# Altium project Fuel_Gauge_Module.PrjPcb
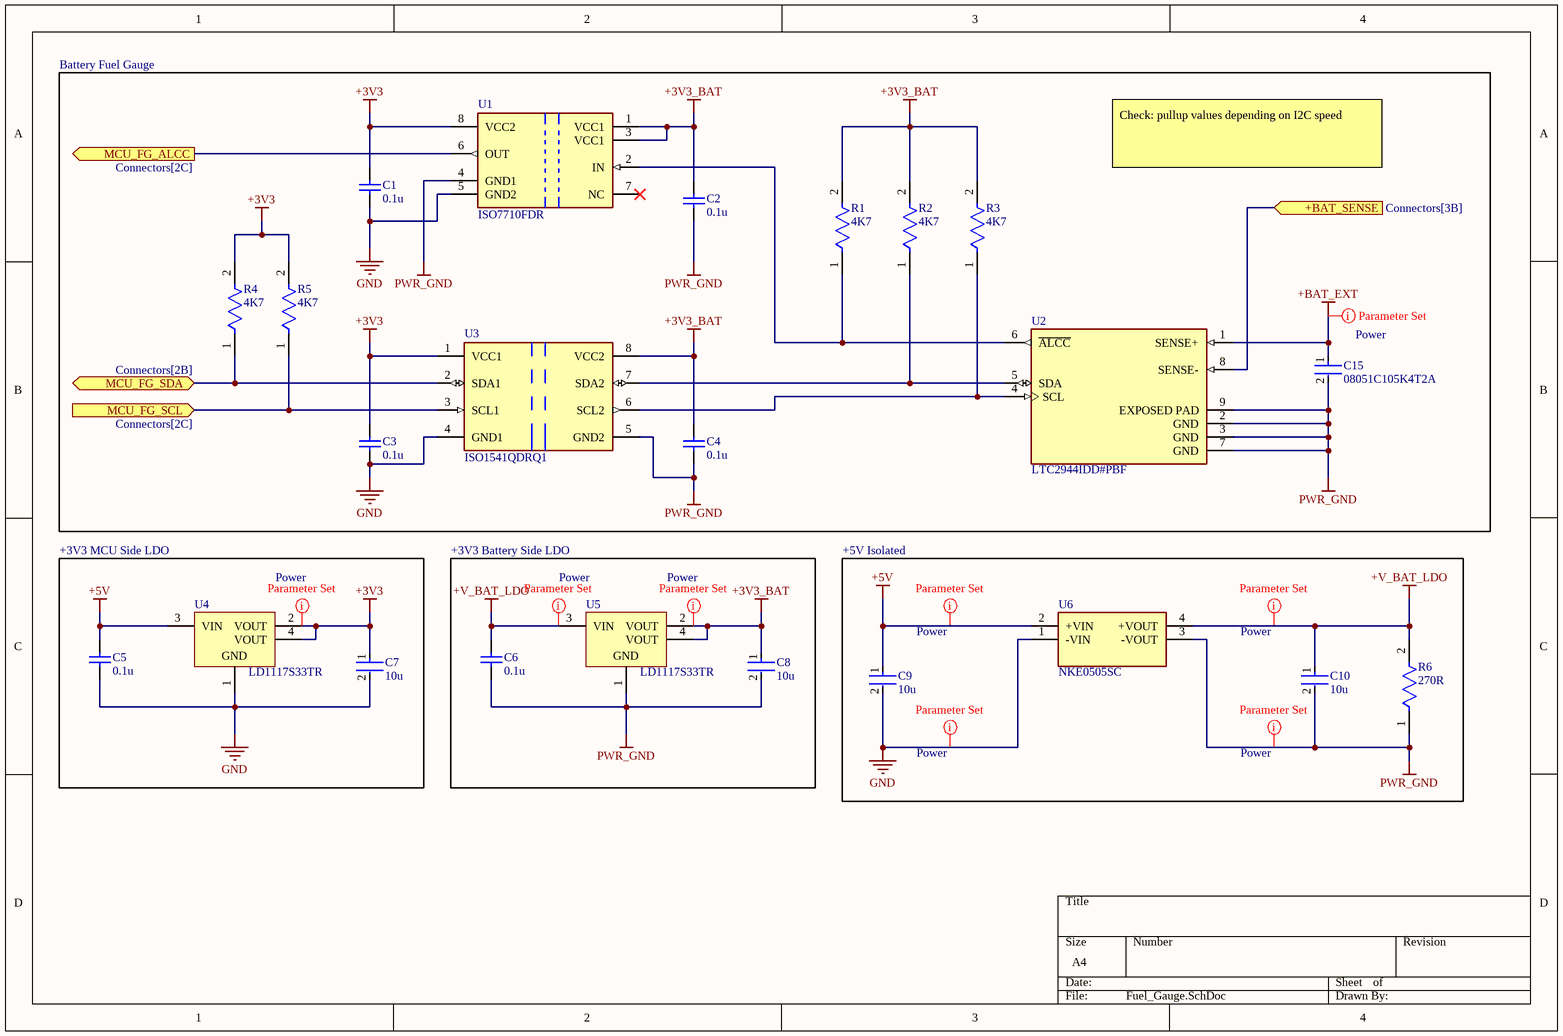
[diagram p0: Fuel_Gauge.SchDoc]
2 sheets, 31 parts. Net scope: flat (ports and power ports of the same name join across sheets).
Board file: Fuel_Gauge.PcbDoc
Sheets:
  Fuel_Gauge.SchDoc
  Connectors.SchDoc

## Sheet Fuel_Gauge.SchDoc
size A4; SheetNumber: 1; SheetTotal: 2

### Parts
C1  0.1u  [CAPC2013X145X48NL20T23]
C2  0.1u  [CAPC2013X145X48NL20T23]
C3  0.1u  [CAPC2013X145X48NL20T23]
C4  0.1u  [CAPC2013X145X48NL20T23]
C5  0.1u  [CAPC2013X145X48NL20T23]
C6  0.1u  [CAPC2013X145X48NL20T23]
C7  10u  [FP-CC1206-FD-MFG]
C8  10u  [FP-CC1206-FD-MFG]
C9  10u  [FP-CC1206-FD-MFG]
C10  10u  [FP-CC1206-FD-MFG]
C15  08051C105K4T2A  [FP-0805-L_2_01_0_2-W_1_25-MFG]
R1  4K7  [FP-RT0805-MFG]
R2  4K7  [FP-RT0805-MFG]
R3  4K7  [FP-RT0805-MFG]
R4  4K7  [FP-RT0805-MFG]
R5  4K7  [FP-RT0805-MFG]
R6  270R  [FP-AF1206-IPC_A]
U1  ISO7710FDR  [FP-D0008B-MFG]
U2  LTC2944IDD#PBF  [FP-DD-8-05-08-1698-MFG]
U3  ISO1541QDRQ1  [FP-D0008A-IPC_B]
U4  LD1117S33TR  [SOT-223_L]
U5  LD1117S33TR  [SOT-223_L]
U6  NKE0505SC  [FP-NKE-SIP-MFG]

### Blocks framed on the sheet
Battery Fuel Gauge: C1-C4 C15 R1-R5 U1-U3
+3V3 MCU Side LDO: C5 C7 U4
+3V3 Battery Side LDO: C6 C8 U5
+5V Isolated: C9 C10 R6 U6

### Ports
+BAT_SENSE (in, see Connectors[3B]), MCU_FG_ALCC (out, see Connectors[2C]), MCU_FG_SCL (in, see Connectors[2C]), MCU_FG_SDA (bidir, see Connectors[2B])

### Nets
+3V3: C1.2 C3.2 C7.1 R4.2 R5.2 U1.8(VCC2) U3.1(VCC1) U4.2(VOUT) U4.4(VOUT)
+3V3_BAT: C2.2 C4.2 C8.1 R1.2 R2.2 R3.2 U1.1(VCC1) U1.3(VCC1) U3.8(VCC2) U5.2(VOUT) U5.4(VOUT)
+5V: C5.2 C9.1 U4.3(VIN) U6.2(+VIN)
+BAT_EXT: C15.1 U2.1(SENSE+)
+V_BAT_LDO: C6.2 C10.1 R6.2 U5.3(VIN) U6.4(+VOUT)
GND: C1.1 C3.1 C5.1 C7.2 C9.2 U1.5(GND2) U3.4(GND1) U4.1(GND) U6.1(-VIN)
PWR_GND: C2.1 C4.1 C6.1 C8.2 C10.2 C15.2 R6.1 U1.4(GND1) U2.2(GND) U2.3(GND) U2.7(GND) U2.9(EXPOSED_PAD) U3.5(GND2) U5.1(GND) U6.3(-VOUT)
NetJ1_9: U1.6(OUT) ; port MCU_FG_ALCC
NetJ1_13: R5.1 U3.3(SCL1) ; port MCU_FG_SCL
NetJ1_17: R4.1 U3.2(SDA1) ; port MCU_FG_SDA
NetP1_1: U2.8(SENSE-) ; port +BAT_SENSE
NetR1_1: R1.1 U1.2(IN) U2.6(~{ALCC})
NetR2_1: R2.1 U2.5(SDA) U3.7(SDA2)
NetR3_1: R3.1 U2.4(SCL) U3.6(SCL2)

Not connected (* = marked no-connect by the designer): U1 7(NC)*

### Layout directives
net class Power: +3V3, +3V3_BAT, +5V, +BAT_EXT, +V_BAT_LDO, GND, PWR_GND

### Notes on the sheet
- Check: pullup values depending on I2C speed

### Library data of the parts
C1-C6 = CMP-2007-01705-1: Part Number: VJ0805Y104KXAMR; Manufacturer: Vitramon
C7-C10 = CMP-03422-001420-1: CAP CER 10UF 50V X5R 1206; Tolerance: 10%; Voltage Rating (DC): 50V; Width: 0.063inch; Halogen Free: Halogen Free; Mount: Surface Mount; Dielectric: X5R; Max Operating Temperature: 85°C; Capacitance: 10uF; Case/Package: 1206; Voltage Rating: 50V; Lead Free: Lead Free; Thickness: 0.075inch; Min Operating Temperature: -55°C; Length: 0.126inch; Packaging: Tape and Reel; RoHS Compliant: Yes
C15 = CMP-07738-122049624-1: 08051C105K4T2A Cap Ceramic 1uF 100V X7R 10% Pad SMD 0805 125C Automotive T/R; Capacitance: 1µF; Tolerance: 10%; Dielectric: X7R; Case/Package: 0805; Material: Ceramic; Height: 1.4mm; Voltage Rating (DC): 100V; Voltage Rating: 100V; Schedule B: 8532240020; NexarPartId: 122049624; RoHS: Compliant; Lifecycle Status: Production; Min Operating Temperature: -55°C; Max Operating Temperature: 125°C
R1-R5 = CMP-03412-025396-1: RT0805 4.7KΩ 0.125W 50 ppm/°C 0.01%; Manufacturer: Yageo; Manufacturer Part Number: RT0805FRE134K7L; Tolerance: 0.0001; Voltage Rating: 150V; Category: Res; Footprint Url: http://www.yageo.com/exep/pages/download/literatures/PYu-R_Mount_10.pdf; Resistance: 4.7KΩ; Package: RT0805; Composition: Thin Film; Device Class L3: Chip SMD Resistors; Ipc Land Pattern Name: RESC200125X50; Temperature Range Low: -55°C; Lead Free: Yes; Temperature Range High: +155°C; Temperature Coefficient: 50 ppm/°C; Octopart: https://octopart.com/rt0805fre134k7l-yageo-16262042; ComponentLink2URL: http://www.yageo.com/documents/recent/PYu-RT_1-to-0.01_RoHS_L_9.pdf; Device Class L1: Passive Components; Value: 4.7KΩ; Automotive: No; Height: 0.6mm; Device Class L2: Resistors; RoHS: TRUE; Power Rating: 0.125W; Temperature: -55°C to +155°C; Series: RT; ComponentLink2Description: Datasheet
R6 = CMP-03412-047403-1: Anti-Sulfurated Chip Resistor Automotive Grade 270Ω 5% 0.25W ±100ppm/°C 1206
U1 = CMP-04872-000020-1: DGTL ISO 3000VRMS 1CH GP 8SOIC; Number of Channels: 1; Min Operating Temperature: -55°C; Max Operating Temperature: 125°C
U2 = CMP-09132-000003-1: IC BATTERY GAS GAUGE I2C 8DFN; Manufacturer: Analog Devices; Nominal Supply Current: 15-850uA; Max Supply Voltage: 60V; Number Of Cells: 1; Standoff Height: 0mm; Min Supply Voltage: 3.6V; Package: DD-8-05-08-1698; Mouser Description: LTC2944 - 60V Battery Gas Gauge with Temperature, Voltage and Current Measurement; Digikey Description: IC BATTERY GAS GAUGE I2C 8DFN; Device Class L1: Integrated Circuits (ICs); Automotive: No; Height: 0.8mm; Temperature: -40°C to +85°C; ComponentLink2Description: Datasheet; Number Of Outputs: 1; Octopart: https://octopart.com/ltc2944idd%23pbf-analog+devices-88318751; Ipc Land Pattern Name: DFN300X300X75-8; Temperature Range Low: -40°C; Lead Free: Yes; ComponentLink2URL: https://www.analog.com/media/en/technical-documentation/data-sheets/2944fa.pdf; Ambient Temperature Range Low: -40°C; Device Class L3: Battery Management; Category: IC; RoHS: TRUE; Manufacturer Part Number: LTC2944IDD#PBF; Ambient Temperature Range High: +85°C; Temperature Range High: +85°C; Device Class L2: Power Management ICs
U3 = CMP-04872-000096-1: AUTO ISO I2C 2500VRMS 2CH 8SOIC; Data Rate: 1Mbps; Number of Channels: 2; Working Voltage: 560V; Channel Type: Bidirectional; Pulse Width Distortion (PWD): 21ns; Isolated Power: No; Mount: Surface Mount; Max Operating Temperature: 125°C; Min Operating Temperature: -40°C; Packaging: Cut Tape; RoHS Compliant: Yes; Case/Package: SOIC; Number of Pins: 8
U4 U5 = CMP-0244-00310-1: Fixed Low Drop Positive Voltage Regulator, 3.3V, 4-Pin SOT-223, Tape and Reel; ComponentLink2Description: Datasheet; PackageDescription: 4-Pin SOT-223 Package, 6.5 x 3.5 mm Body, 2.3 mm Pitch, 7 mm Lead Span; PackageVersion: 2010; ComponentLink2URL: http://www.st.com/internet/com/TECHNICAL_RESOURCES/TECHNICAL_LITERATURE/DATASHEET/CD00000544.pdf; PackageReference: SOT-223; DatasheetVersion: 1/11/2011; ComponentLink1Description: Manufacturer URL; ComponentLink1URL: http://www.st.com
U6 = CMP-20596-000001-1: DC DC CONVERTER 12V 1W; Manufacturer: Murata Power Solutions Inc; Manufacturer Part Number: NKE1212SC; Switching Frequency: 115kHz; Output Type: Fixed; Min Supply Voltage: 10.8V; Switching Topology: Boost; Standoff Height: 0.4mm; Nominal Supply Current: 105mA; Output Current: 83mA; Max Supply Voltage: 13.2V; Number Of Outputs: 1; Device Class L3: Voltage Regulators - Switching; Max Power Dissipation: 1W; ComponentLink2Description: Datasheet; RoHS: TRUE; Category: IC; Digikey Description: DC DC CONVERTER 12V 1W; Lead Free: Yes; Octopart: https://octopart.com/nke1212sc-murata+power+solutions-49448374; Device Class L2: Power Management ICs; Temperature Range Low: -40°C; Height: 7.71mm; ComponentLink2URL: https://power.murata.com/pub/data/power/ncl/kdc_nke.pdf; Package: NKE-SIP; Device Class L1: Integrated Circuits (ICs); Mouser Description: Isolated DC/DC Converters 1W SNGL OUT 12-12V Single Output; Output Voltage: 12V; Automotive: No; Temperature: -40°C to +85°C; Temperature Range High: +85°C

## Sheet Connectors.SchDoc
size A4; SheetNumber: 2; SheetTotal: 2
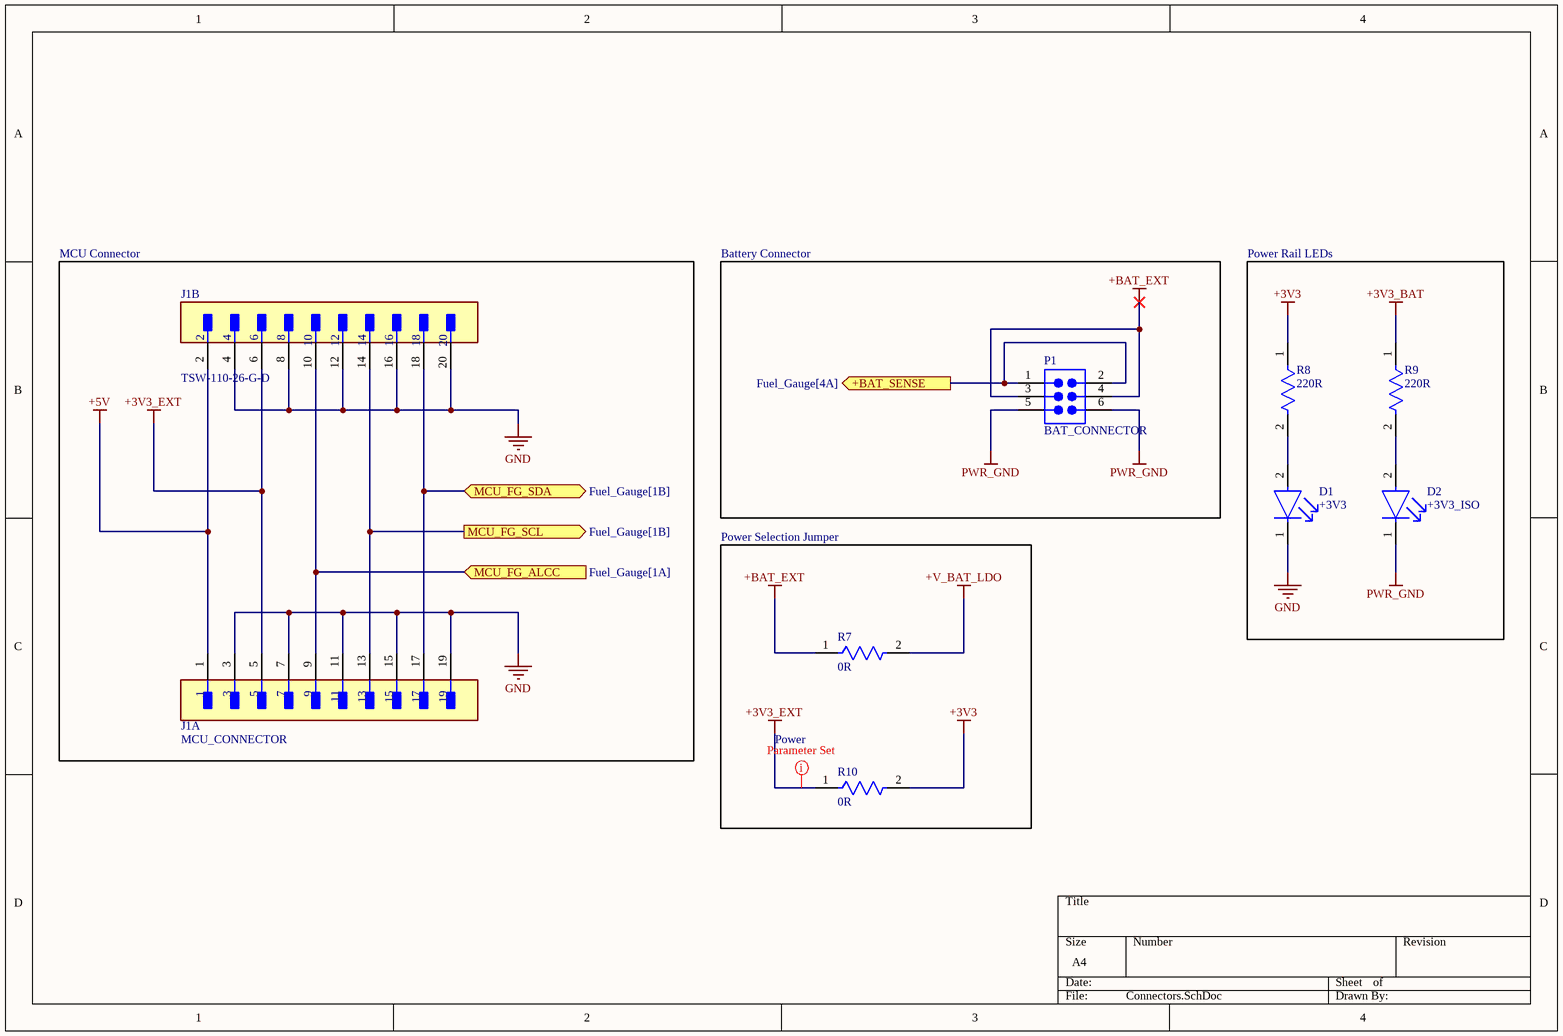
[diagram p1: Connectors.SchDoc]

### Parts
D1  +3V3  [FP-LTST-C170GKT-MFG]
D2  +3V3_ISO  [FP-LTST-C170GKT-MFG]
J1  MCU_CONNECTOR  [FP-TSW-110-26-G-D-MFG]  (parts A,B of 2)
P1  BAT_CONNECTOR  [SMTC-TSW-103-08-X-D]
R7  0R  [FP-AF0805-IPC_B]
R8  220R  [FP-RT0805-MFG]
R9  220R  [FP-RT0805-MFG]
R10  0R  [FP-AF0805-IPC_B]

### Blocks framed on the sheet
MCU Connector: J1
Battery Connector: P1
Power Rail LEDs: D1 D2 R8 R9
Power Selection Jumper: R7 R10

### Ports
+BAT_SENSE (out, see Fuel_Gauge[4A]), MCU_FG_ALCC (in, see Fuel_Gauge[1A]), MCU_FG_SCL (out, see Fuel_Gauge[1B]), MCU_FG_SDA (bidir, see Fuel_Gauge[1B])

### Nets
+3V3: R8.1 R10.2
+3V3_BAT: R9.1
+3V3_EXT: J1.5 J1.6 R10.1
+5V: J1.1 J1.2
+BAT_EXT: P1.3 P1.4 R7.1
+V_BAT_LDO: R7.2
GND: D1.1(C) J1.3 J1.4 J1.7 J1.8 J1.11 J1.12 J1.15 J1.16 J1.19 J1.20
PWR_GND: D2.1(C) P1.5 P1.6
NetD1_2: D1.2(A) R8.2
NetD2_2: D2.2(A) R9.2
NetJ1_9: J1.9 J1.10 ; port MCU_FG_ALCC
NetJ1_13: J1.13 J1.14 ; port MCU_FG_SCL
NetJ1_17: J1.17 J1.18 ; port MCU_FG_SDA
NetP1_1: P1.1 P1.2 ; port +BAT_SENSE

### Layout directives
net class Power: +3V3_EXT

### Library data of the parts
D1 D2 = CMP-1674-00002-6: LED GREEN CLEAR SMD; Dominant Wavelength: 569nm; Lens Style: Diffused; Forward Voltage: 2.1V; Number of Elements: 1; Wavelength: 565nm; Luminous Intensity: 6mcd; Test Current: 10mA; Power Dissipation: 100mW; Reverse Voltage: 5V; Forward Current: 30mA; Viewing Angle: 130°; Lens Color: Colorless; Min Operating Temperature: -55°C; Number of Pins: 2; Max Operating Temperature: 85°C; Color: Green; Radiation Hardening: No; Illumination Color: Green; Case Code (Metric): 2012; Lens Transparency: Clear; Case/Package: 0805; Width: 1.25mm; Case Code (Imperial): 0805; Package Quantity: 1; Height: 1.1mm; Depth: 1.25mm; Length: 2mm; Power Rating: 100mW; Lead Free: Lead Free; Number of LEDs: 1; Packaging: Tape and Reel; Mount: Surface Mount; Voltage: 5V
J1 = CMP-02766-000032-1: CONN HEADER VERT 20POS 2.54MM; Manufacturer Part Number: TSW-110-26-G-D; Manufacturer: Samtec; Conn Orientation: Vertical; Number Of Contacts: 20; Conn Gender: Male; Footprint Url: http://suddendocs.samtec.com/prints/tsw-xxx-xx-x-x-xx-xxx-footprint.pdf; Automotive: No; RoHS: TRUE; Device Class L1: Connectors; Temperature Range Low: -55°C; ComponentLink2Description: Datasheet; Temperature: -55°C to +125°C; Octopart: https://octopart.com/tsw-110-26-g-d-samtec-274552; Category: Conn; Number Of Rows: 2; Lead Free: Yes; Temperature Range High: +125°C; Package: TSW-110-26-G-D; Device Class L2: Headers and Wire Housings; Contact Material: Gold,Nickel; Digikey Description: CONN HEADER VERT 20POS 2.54MM; Height: 8.71mm; ComponentLink2URL: http://suddendocs.samtec.com/prints/tsw-xxx-xx-xxx-x-xx-xxx-mkt.pdf; Pitch: 2.54mm; Device Class L3: unset
P1 = CMP-1024-00338-1: 0.025" SQ Post Header, Through-hole, Vertical, -55 to 125 degC, 2.54 mm Pitch, 6-Pin, Male, RoHS; Manufacturer: Samtec; PartNumber: TSW-103-08-G-D; Pitch: 2.54 mm; ComponentLink1URL: http://www.samtec.com; ComponentLink2URL: http://www.samtec.com/documents/webfiles/pdf/TSW_TH.PDF; Temperature Range: -55 to 125 degC; RoHS: True; ComponentLink2Description: Datasheet; PackageReference: TSW-103-08-X-D; ComponentLink3Description: Package Specification; PackageDescription: .025[0.64] SQ. Post Terminal Strip Assembly; DatasheetVersion: F-214; Mounting Technology: Through-hole; ComponentLink1Description: Manufacturer URL; Orientation: Vertical; PackageVersion: DM, 8/1988; ComponentLink3URL: http://www.samtec.com/documents/webfiles/cpdf/TSW-XXX-XX-XXX-X-XX-XXX-MKT.pdf
R7 R10 = CMP-03412-047152-1: Anti-Sulfurated Chip Resistor Automotive Grade 0Ω Jumper 0.125W 0805; Max Power Dissipation: 125mW; Length: 0.079inch; Package Quantity: 5000; Packaging: Tape and Reel; Height: 0.024inch; Series: AF; Number of Terminations: 2; Resistance: 0R; Weight: 0.000194oz; Width: 1.25mm; Max Operating Temperature: 155°C; Case Code (Metric): 2012; Resistor Type: Thick Film; RoHS Compliant: Yes; Case Code (Imperial): 0805; Min Operating Temperature: -55°C; Case/Package: 0805; Termination: SMD/SMT; Features: Moisture Resistant
R8 R9 = CMP-03412-035594-1: RES SMD 220 OHM 1% 1/8W 0805; Manufacturer Part Number: RT0805FRE07220RL; Manufacturer: Yageo; Power Rating: 0.125W; Voltage Rating: 150V; Temperature Coefficient: 50 ppm/°C; Resistance: 220Ω; Value: 220Ω; Tolerance: 0.0001; Temperature: -55°C to +155°C; Device Class L2: Resistors; ComponentLink2URL: http://www.yageo.com/documents/recent/PYu-RT_1-to-0.01_RoHS_L_9.pdf; Device Class L3: Chip SMD Resistors; Digikey Description: RES SMD 220 OHM 1% 1/8W 0805; Temperature Range Low: -55°C; Ipc Land Pattern Name: RESC200125X50; Height: 0.6mm; Package: RT0805; Automotive: No; RoHS: TRUE; Octopart: https://octopart.com/rt0805fre07220rl-yageo-39797223; Device Class L1: Passive Components; Temperature Range High: +155°C; Footprint Url: http://www.yageo.com/exep/pages/download/literatures/PYu-R_Mount_10.pdf; Lead Free: Yes; Series: RT; Category: Res; Composition: Thin Film; Mouser Description: Res Thin Film 0805 220 Ohm 1% 1/8W ±50ppm/°C SMD Paper T/R; ComponentLink2Description: Datasheet

## Nets that join several sheets
+3V3: Fuel_Gauge (9 pins), Connectors (R8.1 R10.2)
+3V3_BAT: Fuel_Gauge (11 pins), Connectors (R9.1)
+5V: Fuel_Gauge (C5.2 C9.1 U4.3 U6.2), Connectors (J1.1 J1.2)
+BAT_EXT: Fuel_Gauge (C15.1 U2.1), Connectors (P1.3 P1.4 R7.1)
+V_BAT_LDO: Fuel_Gauge (5 pins), Connectors (R7.2)
GND: Fuel_Gauge (9 pins), Connectors (11 pins)
PWR_GND: Fuel_Gauge (15 pins), Connectors (D2.1 P1.5 P1.6)
NetJ1_9: Fuel_Gauge (U1.6), Connectors (J1.9 J1.10)
NetJ1_13: Fuel_Gauge (R5.1 U3.3), Connectors (J1.13 J1.14)
NetJ1_17: Fuel_Gauge (R4.1 U3.2), Connectors (J1.17 J1.18)
NetP1_1: Fuel_Gauge (U2.8), Connectors (P1.1 P1.2)